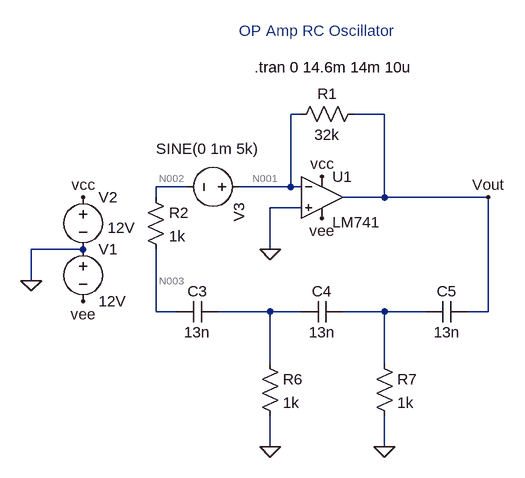
[diagram p0: schematic RC_oscillator_OPAMP.asc]
RC_oscillator_OPAMP.asc, the LTspice schematic file:
Version 4.1
SHEET 1 880 692
WIRE -32 48 -48 48
WIRE 96 48 48 48
WIRE -208 160 -256 160
WIRE -48 160 -48 48
WIRE -48 160 -128 160
WIRE -32 160 -48 160
WIRE -256 176 -256 160
WIRE 96 176 96 48
WIRE 96 176 32 176
WIRE 256 176 96 176
WIRE -32 192 -80 192
WIRE -368 256 -448 256
WIRE -80 256 -80 192
WIRE -448 304 -448 256
WIRE -256 352 -256 256
WIRE -224 352 -256 352
WIRE -80 352 -160 352
WIRE -32 352 -80 352
WIRE 96 352 32 352
WIRE 160 352 96 352
WIRE 256 352 256 176
WIRE 256 352 224 352
WIRE -80 432 -80 352
WIRE 96 432 96 352
WIRE -80 560 -80 512
WIRE 96 560 96 512
FLAG -80 560 0
FLAG 96 560 0
FLAG -448 304 0
FLAG -368 336 vee
FLAG -368 176 vcc
FLAG 0 144 vcc
FLAG 0 208 vee
FLAG -80 256 0
FLAG 256 176 Vout
SYMBOL cap -160 336 R90
WINDOW 0 0 32 VBottom 2
WINDOW 3 32 32 VTop 2
SYMATTR InstName C3
SYMATTR Value 13n
SYMBOL cap 32 336 R90
WINDOW 0 0 32 VBottom 2
WINDOW 3 32 32 VTop 2
SYMATTR InstName C4
SYMATTR Value 13n
SYMBOL cap 224 336 R90
WINDOW 0 0 32 VBottom 2
WINDOW 3 32 32 VTop 2
SYMATTR InstName C5
SYMATTR Value 13n
SYMBOL res -96 416 R0
SYMATTR InstName R6
SYMATTR Value 1k
SYMBOL res 80 416 R0
SYMATTR InstName R7
SYMATTR Value 1k
SYMBOL LM741 0 112 R0
WINDOW 3 16 102 Left 2
SYMATTR InstName U1
SYMBOL voltage -368 240 R0
WINDOW 123 0 0 Left 0
WINDOW 39 0 0 Left 0
SYMATTR InstName V1
SYMATTR Value 12V
SYMBOL voltage -368 160 R0
WINDOW 3 38 63 Left 2
WINDOW 123 0 0 Left 0
WINDOW 39 0 0 Left 0
SYMATTR Value 12V
SYMATTR InstName V2
SYMBOL res 64 32 R90
WINDOW 0 0 56 VBottom 2
WINDOW 3 32 56 VTop 2
SYMATTR InstName R1
SYMATTR Value 32k
SYMBOL res -272 160 R0
SYMATTR InstName R2
SYMATTR Value 1k
SYMBOL voltage -112 160 R90
WINDOW 3 -59 -15 VRight 2
WINDOW 123 0 0 Left 0
WINDOW 39 0 0 Left 0
SYMATTR InstName V3
SYMATTR Value SINE(0 1m 5k)
TEXT -128 -80 Left 2 ;OP Amp RC Oscillator
TEXT -104 -24 Left 2 !.tran 0 14.6m 14m 10u

The netlist it stands for:
* RC_oscillator_OPAMP.asc
C3 N004 N003 13n
C4 N005 N004 13n
C5 Vout N005 13n
R6 N004 0 1k
R7 N005 0 1k
X§U1 0 N001 vcc vee Vout LM741  ; pins In+ In- V+ V- OUT
V1 0 vee 12V
V2 vcc 0 12V
R1 Vout N001 32k
R2 N002 N003 1k
V3 N001 N002 SINE(0 1m 5k)
* OP Amp RC Oscillator
.tran 0 14.6m 14m 10u
.lib LM741.lib
.backanno
.end

* Results of the author's LTspice run, read from the files saved beside the schematic
* Operating Point, zero values left out:
*   V(n003) = 1 mV
*   V(vout) = 4.26 mV
*   V(n001) = 1 mV
*   V(vee) = -12 V
*   V(vcc) = 12 V
*   V(n002) = 1 mV
*   I(V1) = -1.626 mA
*   I(V2) = -1.626 mA
*   I(R1) = 101.9 nA
*   Ix(u1:1) = 57.86 nA
*   Ix(u1:2) = 101.9 nA
*   Ix(u1:99) = 1.626 mA
*   Ix(u1:50) = -1.626 mA
*   Ix(u1:28) = -101.9 nA
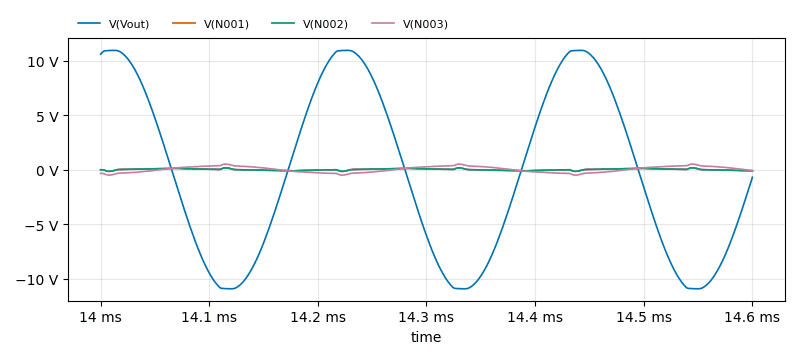
[diagram p1: Transient Analysis of RC_oscillator_OPAMP.asc, plotted from the saved traces]
* Transient Analysis, 1 run:
*   V(Vout): min -10.93 V, max 10.93 V, average -414.7 mV, rms 7.881 V, last -706.3 mV
*   V(N001): min -160.6 mV, max 156.7 mV, average 5.64 mV, rms 74.39 mV, last -110.9 mV
*   V(N002): min -161.5 mV, max 157.5 mV, average 5.64 mV, rms 74.2 mV, last -110.9 mV
*   V(N003): min -507.9 mV, max 504 mV, average 18.89 mV, rms 272.8 mV, last -92.47 mV